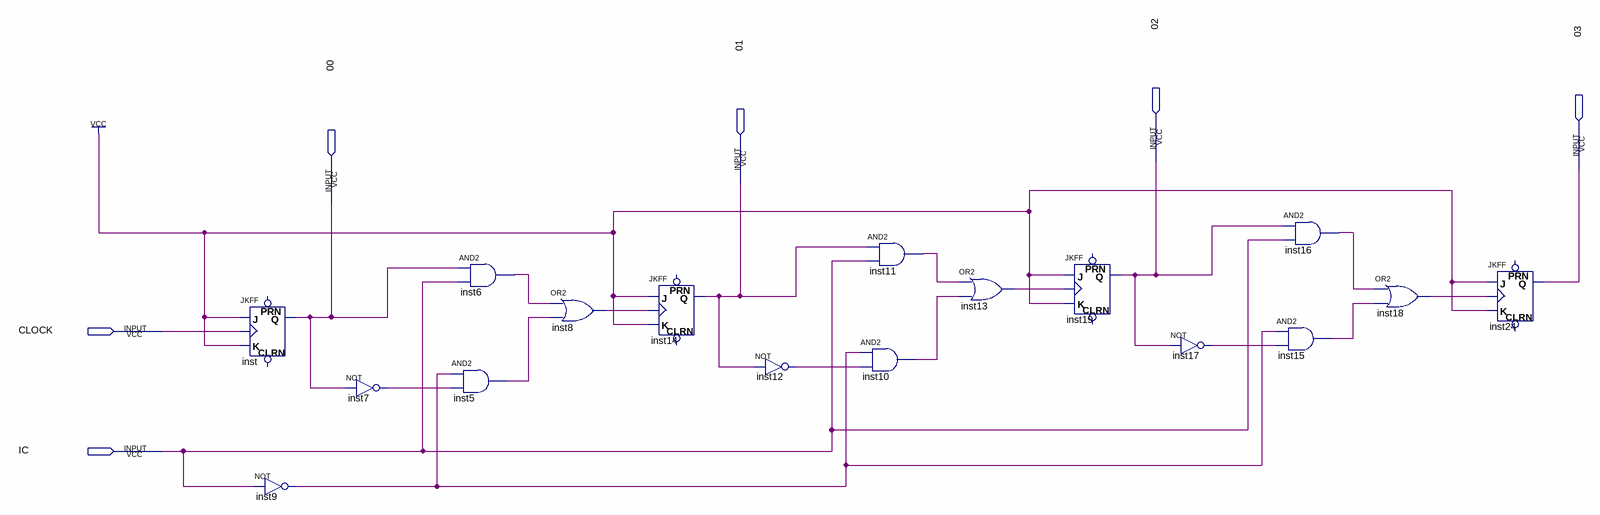
[diagram p0: schematic sheet]
// Quartus schematic reversivel.bdf as structural Verilog: 17 symbols, 6 pins
module reversivel (
  input  \02 ,
  input  \03 ,
  input  \01 ,
  input  \00 ,
  input  CLOCK,
  input  IC
);

  wire inst5_out, inst6_out, inst7_out, inst8_out, inst9_out, inst10_out, inst11_out, inst12_out, inst13_out,
       inst15_out, inst16_out, inst17_out, inst18_out;

  JKFF inst (.K(1'b1), .J(1'b1), .CLK(CLOCK), .Q(\00 ));  // open: PRN, CLRN
  not inst9 (inst9_out, IC);
  not inst7 (inst7_out, \00 );
  and inst5 (inst5_out, inst9_out, inst7_out);
  and inst6 (inst6_out, \00 , IC);
  or inst8 (inst8_out, inst6_out, inst5_out);
  JKFF inst14 (.K(1'b1), .J(1'b1), .CLK(inst8_out), .Q(\01 ));  // open: PRN, CLRN
  not inst12 (inst12_out, \01 );
  and inst11 (inst11_out, \01 , IC);
  and inst10 (inst10_out, inst9_out, inst12_out);
  or inst13 (inst13_out, inst11_out, inst10_out);
  JKFF inst19 (.K(1'b1), .J(1'b1), .CLK(inst13_out), .Q(\02 ));  // open: PRN, CLRN
  not inst17 (inst17_out, \02 );
  and inst16 (inst16_out, \02 , IC);
  and inst15 (inst15_out, inst9_out, inst17_out);
  or inst18 (inst18_out, inst16_out, inst15_out);
  JKFF inst24 (.K(1'b1), .J(1'b1), .CLK(inst18_out), .Q(\03 ));  // open: PRN, CLRN
endmodule
